# EAGLE schematic fc (EAGLE 5.10)
COPYRIGHT: 213|238|225|225|232; DESCRIPTION_1: 209|245|229|236|224|32|253|235|229|234|242|240|232|247|229|241|234|224|255; DESCRIPTION_2: 239|240|232|237|232|246|232|239|232|224|235|252|237|224|255; DESCRIPTION_3: 247|224|241|242|238|242|238|236|229|240|224; NUMBER: 213|213|213|46|48|48|48|46|48|48|48|46|48|48|48

## Sheet 1 of 4
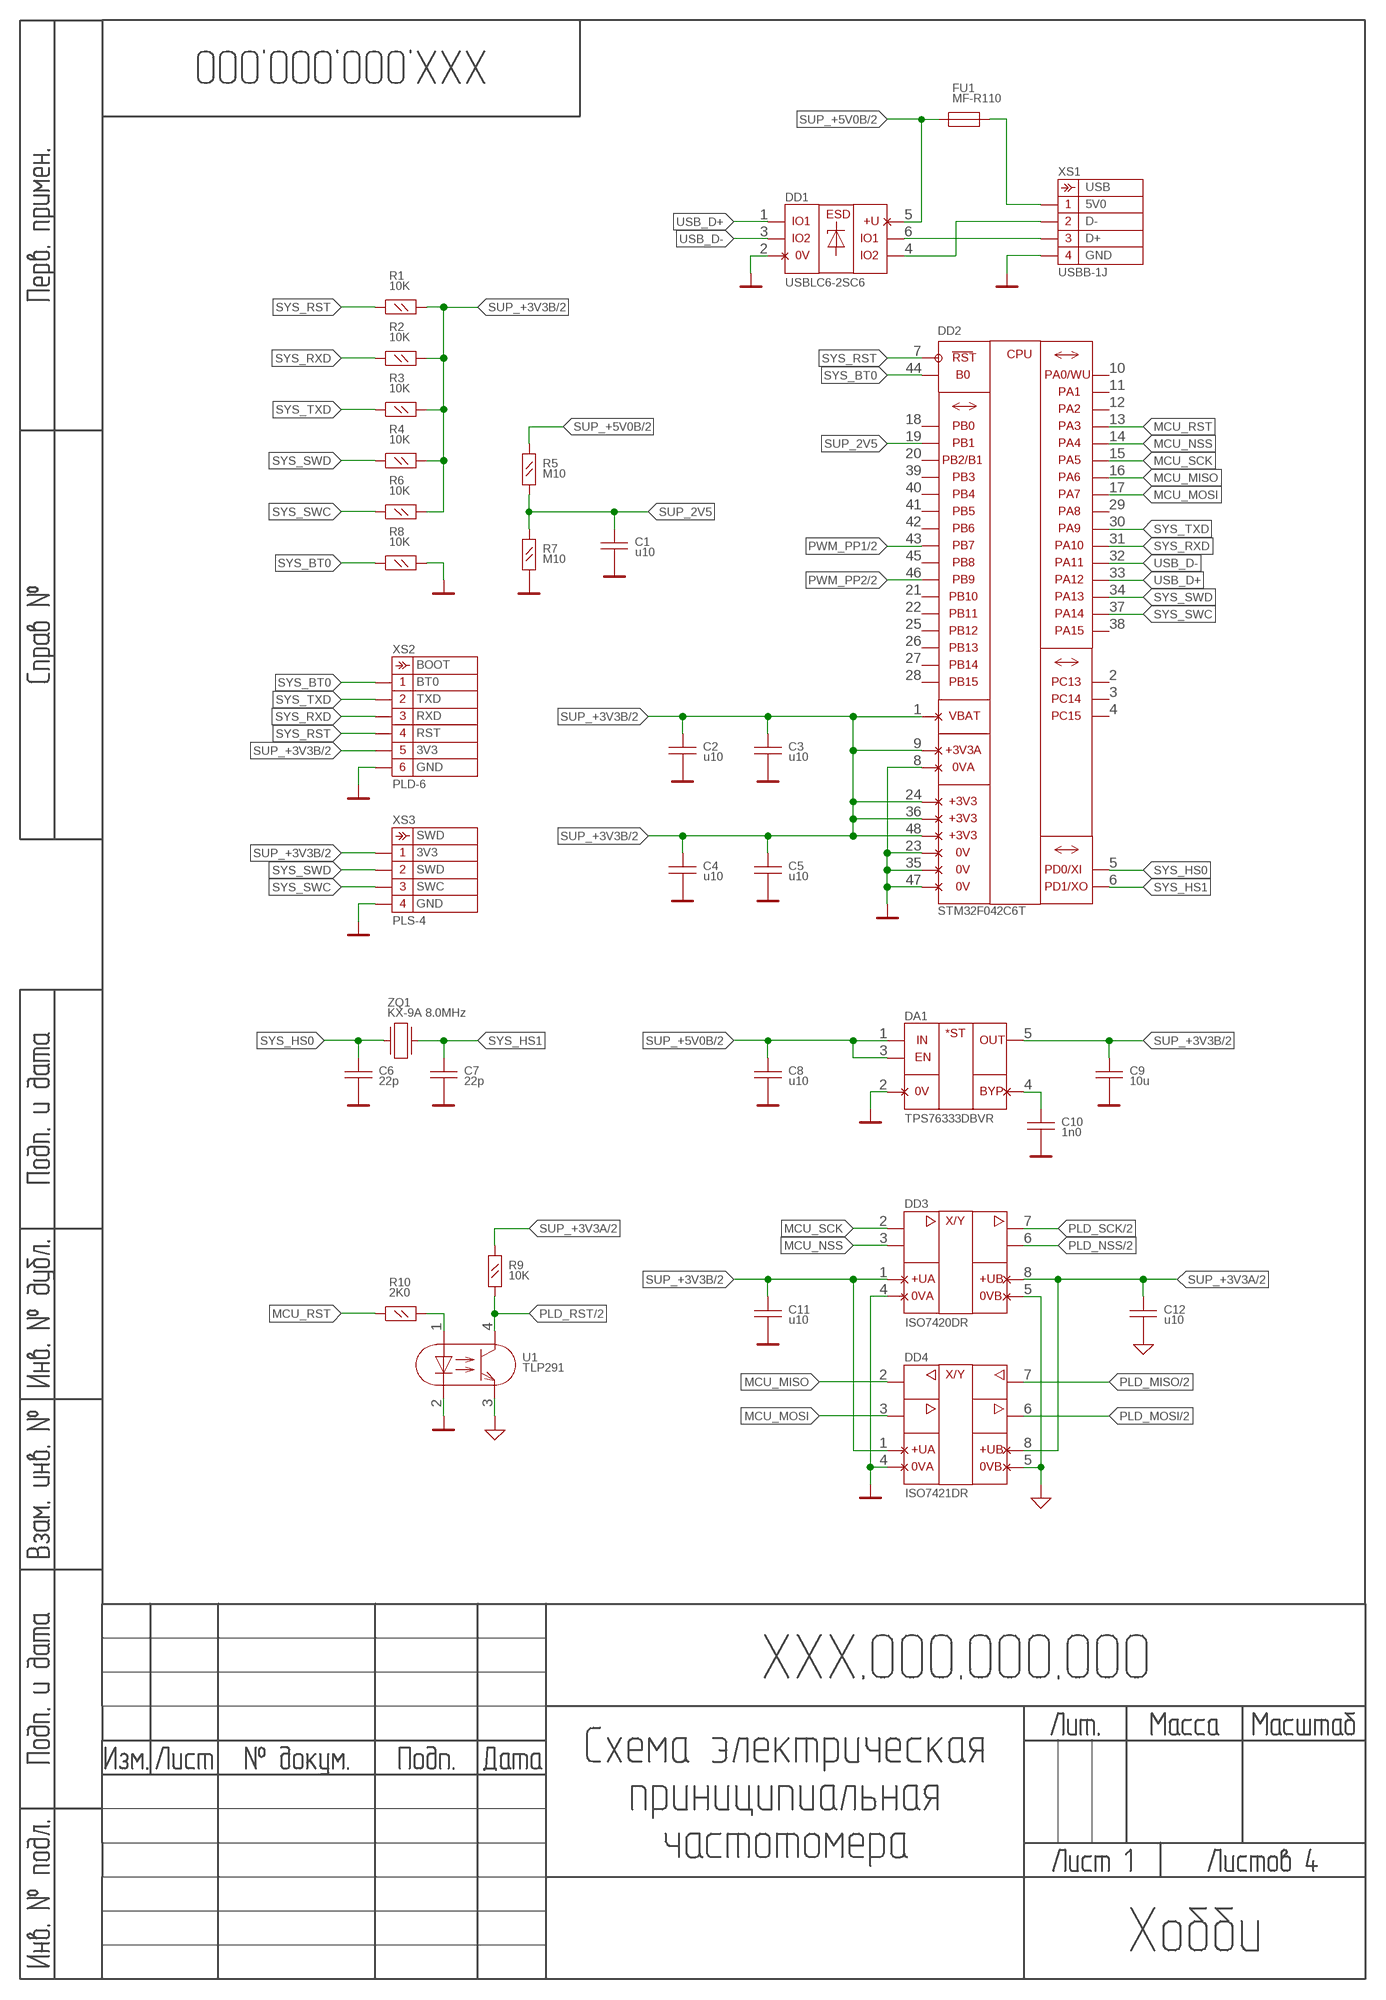
[diagram p0: schematic, sheet 1]

### Parts
C1  u10  CAPACITOR/GENERIC-0805  [GENERIC/0805]
C2  u10  CAPACITOR/GENERIC-0805  [GENERIC/0805]
C3  u10  CAPACITOR/GENERIC-0805  [GENERIC/0805]
C4  u10  CAPACITOR/GENERIC-0805  [GENERIC/0805]
C5  u10  CAPACITOR/GENERIC-0805  [GENERIC/0805]
C6  22p  CAPACITOR/GENERIC-0805  [GENERIC/0805]
C7  22p  CAPACITOR/GENERIC-0805  [GENERIC/0805]
C8  u10  CAPACITOR/GENERIC-0805  [GENERIC/0805]
C9  10u  CAPACITOR/GENERIC-0805  [GENERIC/0805]
C10  1n0  CAPACITOR/GENERIC-0805  [GENERIC/0805]
C11  u10  CAPACITOR/GENERIC-0805  [GENERIC/0805]
C12  u10  CAPACITOR/GENERIC-0805  [GENERIC/0805]
DA1  TPS76333DBVR  ANALOG/REGULATOR/LDK120-SOT23-5  [GENERIC/SOT23-5]
DD1  USBLC6-2SC6  DIGITAL/USBLC6-SOT23-6  [GENERIC/SOT23-6]
DD2  STM32F042C6T  DIGITAL/STM32F10XCXX-QFP48  [LQFP48]
DD3  ISO7420DR  DIGITAL/ADUM1200-SO08  [SO08]
DD4  ISO7421DR  DIGITAL/ADUM1201-SO08  [SO08]
FU1  MF-R110  FUSE-MF-R  [CAPACITOR/3]
R1  10K  RESISTOR/0.125-0805  [GENERIC/0805]
R2  10K  RESISTOR/0.125-0805  [GENERIC/0805]
R3  10K  RESISTOR/0.125-0805  [GENERIC/0805]
R4  10K  RESISTOR/0.125-0805  [GENERIC/0805]
R5  M10  RESISTOR/0.125-0805  [GENERIC/0805]
R6  10K  RESISTOR/0.125-0805  [GENERIC/0805]
R7  M10  RESISTOR/0.125-0805  [GENERIC/0805]
R8  10K  RESISTOR/0.125-0805  [GENERIC/0805]
R9  10K  RESISTOR/0.125-0805  [GENERIC/0805]
R10  2K0  RESISTOR/0.125-0805  [GENERIC/0805]
U1  TLP291  TRANSISTOR/OPTRON/TLP521-1-SO04  [SO04]
XS1  USBB-1J  CONNECTOR/4-USBB-F  [CONNECTOR/4/USBB-F]
XS2  PLD-6  CONNECTOR:6-PLD  [CONNECTOR:6:PLD]
XS3  PLS-4  CONNECTOR/4-PLS  [CONNECTOR/4/PLS]
ZQ1  KX-9A 8.0MHz  QUARTZ/GENERIC-KX-9A  [QUARTZ/KX-9A]

### Nets
0V: C1.2 C2.2 C3.2 C4.2 C5.2 C6.2 C7.2 C8.2 C9.2 C10.2 C11.2 DA1.2(0V) DD1.2(GND) DD2.8(GNDA) DD2.23(GND0) DD2.35(GND1) DD2.47(GND2) DD3.4(GND1) DD4.4(GND1) R7.2 R8.2 U1.2(CATHODE) XS1.4 XS2.6 XS3.4 ; also sheet 2
0VA: C12.2 DD3.5(GND2) DD4.5(GND2) U1.3(EMITTER) ; also sheet 2,3,4
MCU_MISO: DD2.16(PA6) DD4.2(OUTA)
MCU_MOSI: DD2.17(PA7) DD4.3(INB)
MCU_NSS: DD2.14(PA4) DD3.3(INB)
MCU_RST: DD2.13(PA3) R10.1
MCU_SCK: DD2.15(PA5) DD3.2(INA)
N$73: DD1.4(IO22) XS1.2
N$74: DD1.6(IO21) XS1.3
N$75: FU1.2 XS1.1
N$76: R10.2 U1.1(ANODE)
N$79: C10.1 DA1.4(BYP)
PLD_MISO: DD4.7(INA) ; also sheet 2
PLD_MOSI: DD4.6(OUTB) ; also sheet 2
PLD_NSS: DD3.6(OUTB) ; also sheet 2
PLD_RST: R9.2 U1.4(COLLECTOR) ; also sheet 2
PLD_SCK: DD3.7(OUTA) ; also sheet 2
PWM_PP1: DD2.43(PB7) ; also sheet 2
PWM_PP2: DD2.46(PB9) ; also sheet 2
SUP_2V5: C1.1 DD2.19(PB1) R5.2 R7.1
SUP_+3V3A: C12.1 DD3.8(VDD2) DD4.8(VDD2) R9.1 ; also sheet 2,3,4
SUP_+3V3B: C2.1 C3.1 C4.1 C5.1 C9.1 C11.1 DA1.5(OUT) DD2.1(VBAT) DD2.9(VCCA) DD2.24(VCC0) DD2.36(VCC1) DD2.48(VCC2) DD3.1(VDD1) DD4.1(VDD1) R1.2 R2.2 R3.2 R4.2 R6.2 XS2.5 XS3.1 ; also sheet 2
SUP_+5V0B: C8.1 DA1.1(IN) DA1.3(EN) DD1.5(VCC) FU1.1 R5.1 ; also sheet 2
SYS_BT0: DD2.44(BOOT0) R8.1 XS2.1
SYS_HS0: C6.1 DD2.5(PD0) ZQ1.1
SYS_HS1: C7.1 DD2.6(PD1) ZQ1.3
SYS_RST: DD2.7(NRST) R1.1 XS2.4
SYS_RXD: DD2.31(PA10) R2.1 XS2.3
SYS_SWC: DD2.37(PA14) R6.1 XS3.3
SYS_SWD: DD2.34(PA13) R4.1 XS3.2
SYS_TXD: DD2.30(PA9) R3.1 XS2.2
USB_D+: DD1.1(IO11) DD2.33(PA12)
USB_D-: DD1.3(IO12) DD2.32(PA11)
Unconnected: DD2.2(PC13) DD2.3(PC14) DD2.4(PC15) DD2.10(PA0) DD2.11(PA1) DD2.12(PA2) DD2.18(PB0) DD2.20(PB2) DD2.21(PB10) DD2.22(PB11) DD2.25(PB12) DD2.26(PB13) DD2.27(PB14) DD2.28(PB15) DD2.29(PA8) DD2.38(PA15) DD2.39(PB3) DD2.40(PB4) DD2.41(PB5) DD2.42(PB6) DD2.45(PB8)

### Notes on the sheet
- USB
- 5V0
- D-
- D+
- GND
- BOOT
- BT0
- TXD
- RXD
- RST
- 3V3
- GND
- SWD
- 3V3
- SWD
- SWC
- GND

## Sheet 2 of 4
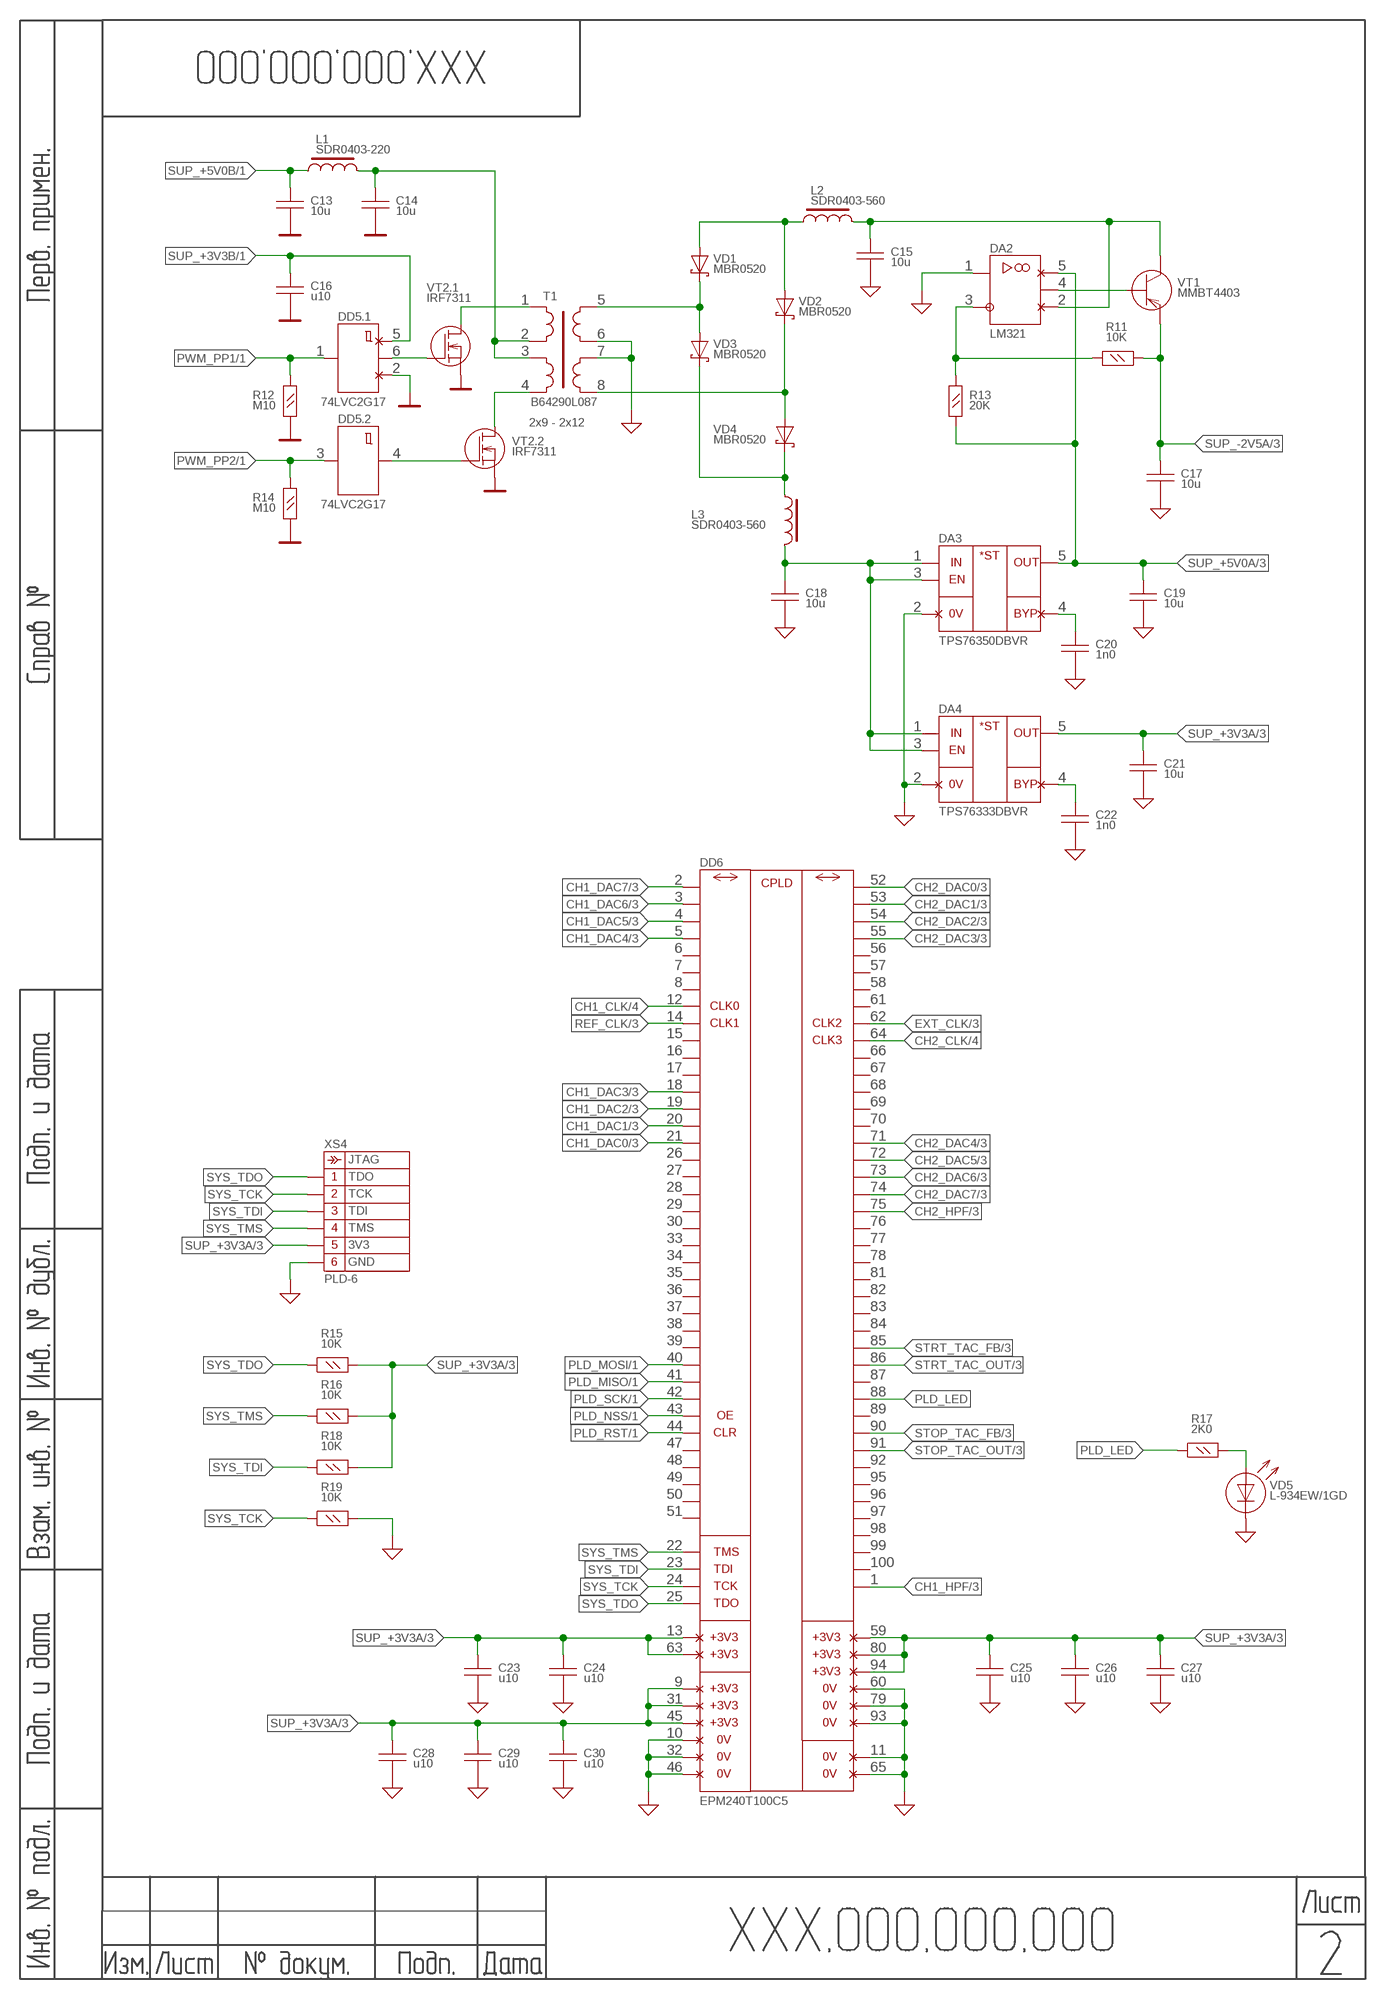
[diagram p1: schematic, sheet 2]

### Parts
C13  10u  CAPACITOR/GENERIC-0805  [GENERIC/0805]
C14  10u  CAPACITOR/GENERIC-0805  [GENERIC/0805]
C15  10u  CAPACITOR/GENERIC-0805  [GENERIC/0805]
C16  u10  CAPACITOR/GENERIC-0805  [GENERIC/0805]
C17  10u  CAPACITOR/GENERIC-0805  [GENERIC/0805]
C18  10u  CAPACITOR/GENERIC-0805  [GENERIC/0805]
C19  10u  CAPACITOR/GENERIC-0805  [GENERIC/0805]
C20  1n0  CAPACITOR/GENERIC-0805  [GENERIC/0805]
C21  10u  CAPACITOR/GENERIC-0805  [GENERIC/0805]
C22  1n0  CAPACITOR/GENERIC-0805  [GENERIC/0805]
C23  u10  CAPACITOR/GENERIC-0805  [GENERIC/0805]
C24  u10  CAPACITOR/GENERIC-0805  [GENERIC/0805]
C25  u10  CAPACITOR/GENERIC-0805  [GENERIC/0805]
C26  u10  CAPACITOR/GENERIC-0805  [GENERIC/0805]
C27  u10  CAPACITOR/GENERIC-0805  [GENERIC/0805]
C28  u10  CAPACITOR/GENERIC-0805  [GENERIC/0805]
C29  u10  CAPACITOR/GENERIC-0805  [GENERIC/0805]
C30  u10  CAPACITOR/GENERIC-0805  [GENERIC/0805]
DA2  LM321  ANALOG/OPAMP/LMV321-SOT23-5  [GENERIC/SOT23-5]
DA3  TPS76350DBVR  ANALOG/REGULATOR/LDK120-SOT23-5  [GENERIC/SOT23-5]
DA4  TPS76333DBVR  ANALOG/REGULATOR/LDK120-SOT23-5  [GENERIC/SOT23-5]
DD5  74LVC2G17  DIGITAL/74HC2G17-SOT23-6  [GENERIC/SOT23-6]
DD6  EPM240T100C5  DIGITAL/EPM240-QFP100  [LQFP100]
L1  SDR0403-220  INDUCTOR/CORE-SDR0403  [INDUCTOR/SDR0403]
L2  SDR0403-560  INDUCTOR/CORE-SDR0403  [INDUCTOR/SDR0403]
L3  SDR0403-560  INDUCTOR/CORE-SDR0403  [INDUCTOR/SDR0403]
R11  10K  RESISTOR/0.125-0805  [GENERIC/0805]
R12  M10  RESISTOR/0.125-0805  [GENERIC/0805]
R13  20K  RESISTOR/0.125-0805  [GENERIC/0805]
R14  M10  RESISTOR/0.125-0805  [GENERIC/0805]
R15  10K  RESISTOR/0.125-0805  [GENERIC/0805]
R16  10K  RESISTOR/0.125-0805  [GENERIC/0805]
R17  2K0  RESISTOR/0.125-0805  [GENERIC/0805]
R18  10K  RESISTOR/0.125-0805  [GENERIC/0805]
R19  10K  RESISTOR/0.125-0805  [GENERIC/0805]
T1  B64290L087  TRANSFORMER/2-2-2-2-B64290L  [TRANSFORMER/B64290L]
VD1  MBR0520  DIODE/SCHOTTKY-SOD123  [GENERIC/SOD123]
VD2  MBR0520  DIODE/SCHOTTKY-SOD123  [GENERIC/SOD123]
VD3  MBR0520  DIODE/SCHOTTKY-SOD123  [GENERIC/SOD123]
VD4  MBR0520  DIODE/SCHOTTKY-SOD123  [GENERIC/SOD123]
VD5  L-934EW/1GD  DIODE/LED-3MM-R  [LED/3/R]
VT1  MMBT4403  TRANSISTOR/PNP-SOT23(BEC)  [GENERIC/SOT23]
VT2  IRF7311  TRANSISTOR/MOSFET/2NE-SO08  [SO08/6]
XS4  PLD-6  CONNECTOR/6-PLD  [CONNECTOR/6/PLD]

### Nets
0V: C13.2 C14.2 C16.2 DD5.2(.0:0V) R12.2 R14.2 VT2.1(.1:SOURCE) VT2.3(.2:SOURCE) ; also sheet 1
0VA: C15.2 C17.2 C18.2 C19.2 C20.2 C21.2 C22.2 C23.2 C24.2 C25.2 C26.2 C27.2 C28.2 C29.2 C30.2 DA2.1(POSITIVE) DA3.2(0V) DA4.2(0V) DD6.10(GNDIO1_1) DD6.11(GNDINT_1) DD6.32(GNDIO1_2) DD6.46(GNDIO1_3) DD6.60(GNDIO2_1) DD6.65(GNDINT_2) DD6.79(GNDIO2_2) DD6.93(GNDIO2_3) R19.2 T1.6 T1.7 VD5.K(CATHODE) XS4.6 ; also sheet 1,3,4
CH1_CLK: DD6.12(IOB1_8) ; also sheet 4
CH1_DAC0: DD6.21(IOB1_16) ; also sheet 3
CH1_DAC1: DD6.20(IOB1_15) ; also sheet 3
CH1_DAC2: DD6.19(IOB1_14) ; also sheet 3
CH1_DAC3: DD6.18(IOB1_13) ; also sheet 3
CH1_DAC4: DD6.5(IOB1_4) ; also sheet 3
CH1_DAC5: DD6.4(IOB1_3) ; also sheet 3
CH1_DAC6: DD6.3(IOB1_2) ; also sheet 3
CH1_DAC7: DD6.2(IOB1_1) ; also sheet 3
CH1_HPF: DD6.1(IOB2_42) ; also sheet 3
CH2_CLK: DD6.64(IOB2_10) ; also sheet 4
CH2_DAC0: DD6.52(IOB2_1) ; also sheet 3
CH2_DAC1: DD6.53(IOB2_2) ; also sheet 3
CH2_DAC2: DD6.54(IOB2_3) ; also sheet 3
CH2_DAC3: DD6.55(IOB2_4) ; also sheet 3
CH2_DAC4: DD6.71(IOB2_16) ; also sheet 3
CH2_DAC5: DD6.72(IOB2_17) ; also sheet 3
CH2_DAC6: DD6.73(IOB2_18) ; also sheet 3
CH2_DAC7: DD6.74(IOB2_19) ; also sheet 3
CH2_HPF: DD6.75(IOB2_20) ; also sheet 3
EXT_CLK: DD6.62(IOB2_9) ; also sheet 3
N$64: R17.2 VD5.A(ANODE)
N$71: C14.1 L1.2 T1.2 T1.3
N$77: T1.4 VT2.5,6(.2:DRAIN)
N$78: DA2.3(NEGATIVE) R11.2 R13.1
N$80: T1.1 VT2.7,8(.1:DRAIN)
N$81: DD5.4(.2:Y) VT2.4(.2:GATE)
N$82: DD5.6(.1:Y) VT2.2(.1:GATE)
N$83: T1.8 VD2.C(CATHODE) VD4.A(ANODE)
N$84: T1.5 VD1.C(CATHODE) VD3.A(ANODE)
N$85: L3.1 VD3.C(CATHODE) VD4.C(CATHODE)
N$86: L2.1 VD1.A(ANODE) VD2.A(ANODE)
N$87: DA2.4(OUT) VT1.1(BASE)
N$88: C18.1 DA3.1(IN) DA3.3(EN) DA4.1(IN) DA4.3(EN) L3.2
N$89: C20.1 DA3.4(BYP)
N$90: C22.1 DA4.4(BYP)
N$91: C15.1 DA2.2(-U) L2.2 VT1.3(COLLECTOR)
PLD_LED: DD6.88(IOB2_31) R17.1
PLD_MISO: DD6.41(IOB1_30) ; also sheet 1
PLD_MOSI: DD6.40(IOB1_29) ; also sheet 1
PLD_NSS: DD6.43(IOB1_32) ; also sheet 1
PLD_RST: DD6.44(IOB1_33) ; also sheet 1
PLD_SCK: DD6.42(IOB1_31) ; also sheet 1
PWM_PP1: DD5.1(.1:A) R12.1 ; also sheet 1
PWM_PP2: DD5.3(.2:A) R14.1 ; also sheet 1
REF_CLK: DD6.14(IOB1_9) ; also sheet 3
STOP_TAC_FB: DD6.90(IOB2_33) ; also sheet 3
STOP_TAC_OUT: DD6.91(IOB2_34) ; also sheet 3
STRT_TAC_FB: DD6.85(IOB2_28) ; also sheet 3
STRT_TAC_OUT: DD6.86(IOB2_29) ; also sheet 3
SUP_+3V3A: C21.1 C23.1 C24.1 C25.1 C26.1 C27.1 C28.1 C29.1 C30.1 DA4.5(OUT) DD6.9(VCCIO1_1) DD6.13(VCCINT_1) DD6.31(VCCIO1_2) DD6.45(VCCIO1_3) DD6.59(VCCIO2_1) DD6.63(VCCINT_2) DD6.80(VCCIO2_2) DD6.94(VCCIO2_3) R15.2 R16.2 R18.2 XS4.5 ; also sheet 1,3,4
SUP_+3V3B: C16.1 DD5.5(.0:+U) ; also sheet 1
SUP_+5V0A: C19.1 DA2.5(+U) DA3.5(OUT) R13.2 ; also sheet 3,4
SUP_+5V0B: C13.1 L1.1 ; also sheet 1
SUP_-2V5A: C17.1 R11.1 VT1.2(EMITTER) ; also sheet 3,4
SYS_TCK: DD6.24(TCK) R19.1 XS4.2
SYS_TDI: DD6.23(TDI) R18.1 XS4.3
SYS_TDO: DD6.25(TDO) R15.1 XS4.1
SYS_TMS: DD6.22(TMS) R16.1 XS4.4
Unconnected: DD6.6(IOB1_5) DD6.7(IOB1_6) DD6.8(IOB1_7) DD6.15(IOB1_10) DD6.16(IOB1_11) DD6.17(IOB1_12) DD6.26(IOB1_17) DD6.27(IOB1_18) DD6.28(IOB1_19) DD6.29(IOB1_20) DD6.30(IOB1_21) DD6.33(IOB1_22) DD6.34(IOB1_23) DD6.35(IOB1_24) DD6.36(IOB1_25) DD6.37(IOB1_26) DD6.38(IOB1_27) DD6.39(IOB1_28) DD6.47(IOB1_34) DD6.48(IOB1_35) DD6.49(IOB1_36) DD6.50(IOB1_37) DD6.51(IOB1_38) DD6.56(IOB2_5) DD6.57(IOB2_6) DD6.58(IOB2_7) DD6.61(IOB2_8) DD6.66(IOB2_11) DD6.67(IOB2_12) DD6.68(IOB2_13) DD6.69(IOB2_14) DD6.70(IOB2_15) DD6.76(IOB2_21) DD6.77(IOB2_22) DD6.78(IOB2_23) DD6.81(IOB2_24) DD6.82(IOB2_25) DD6.83(IOB2_26) DD6.84(IOB2_27) DD6.87(IOB2_30) DD6.89(IOB2_32) DD6.92(IOB2_35) DD6.95(IOB2_36) DD6.96(IOB2_37) DD6.97(IOB2_38) DD6.98(IOB2_39) DD6.99(IOB2_40) DD6.100(IOB2_41)

### Notes on the sheet
- 2x9 - 2x12
- JTAG
- TDO
- TCK
- TDI
- TMS
- 3V3
- GND

## Sheet 3 of 4
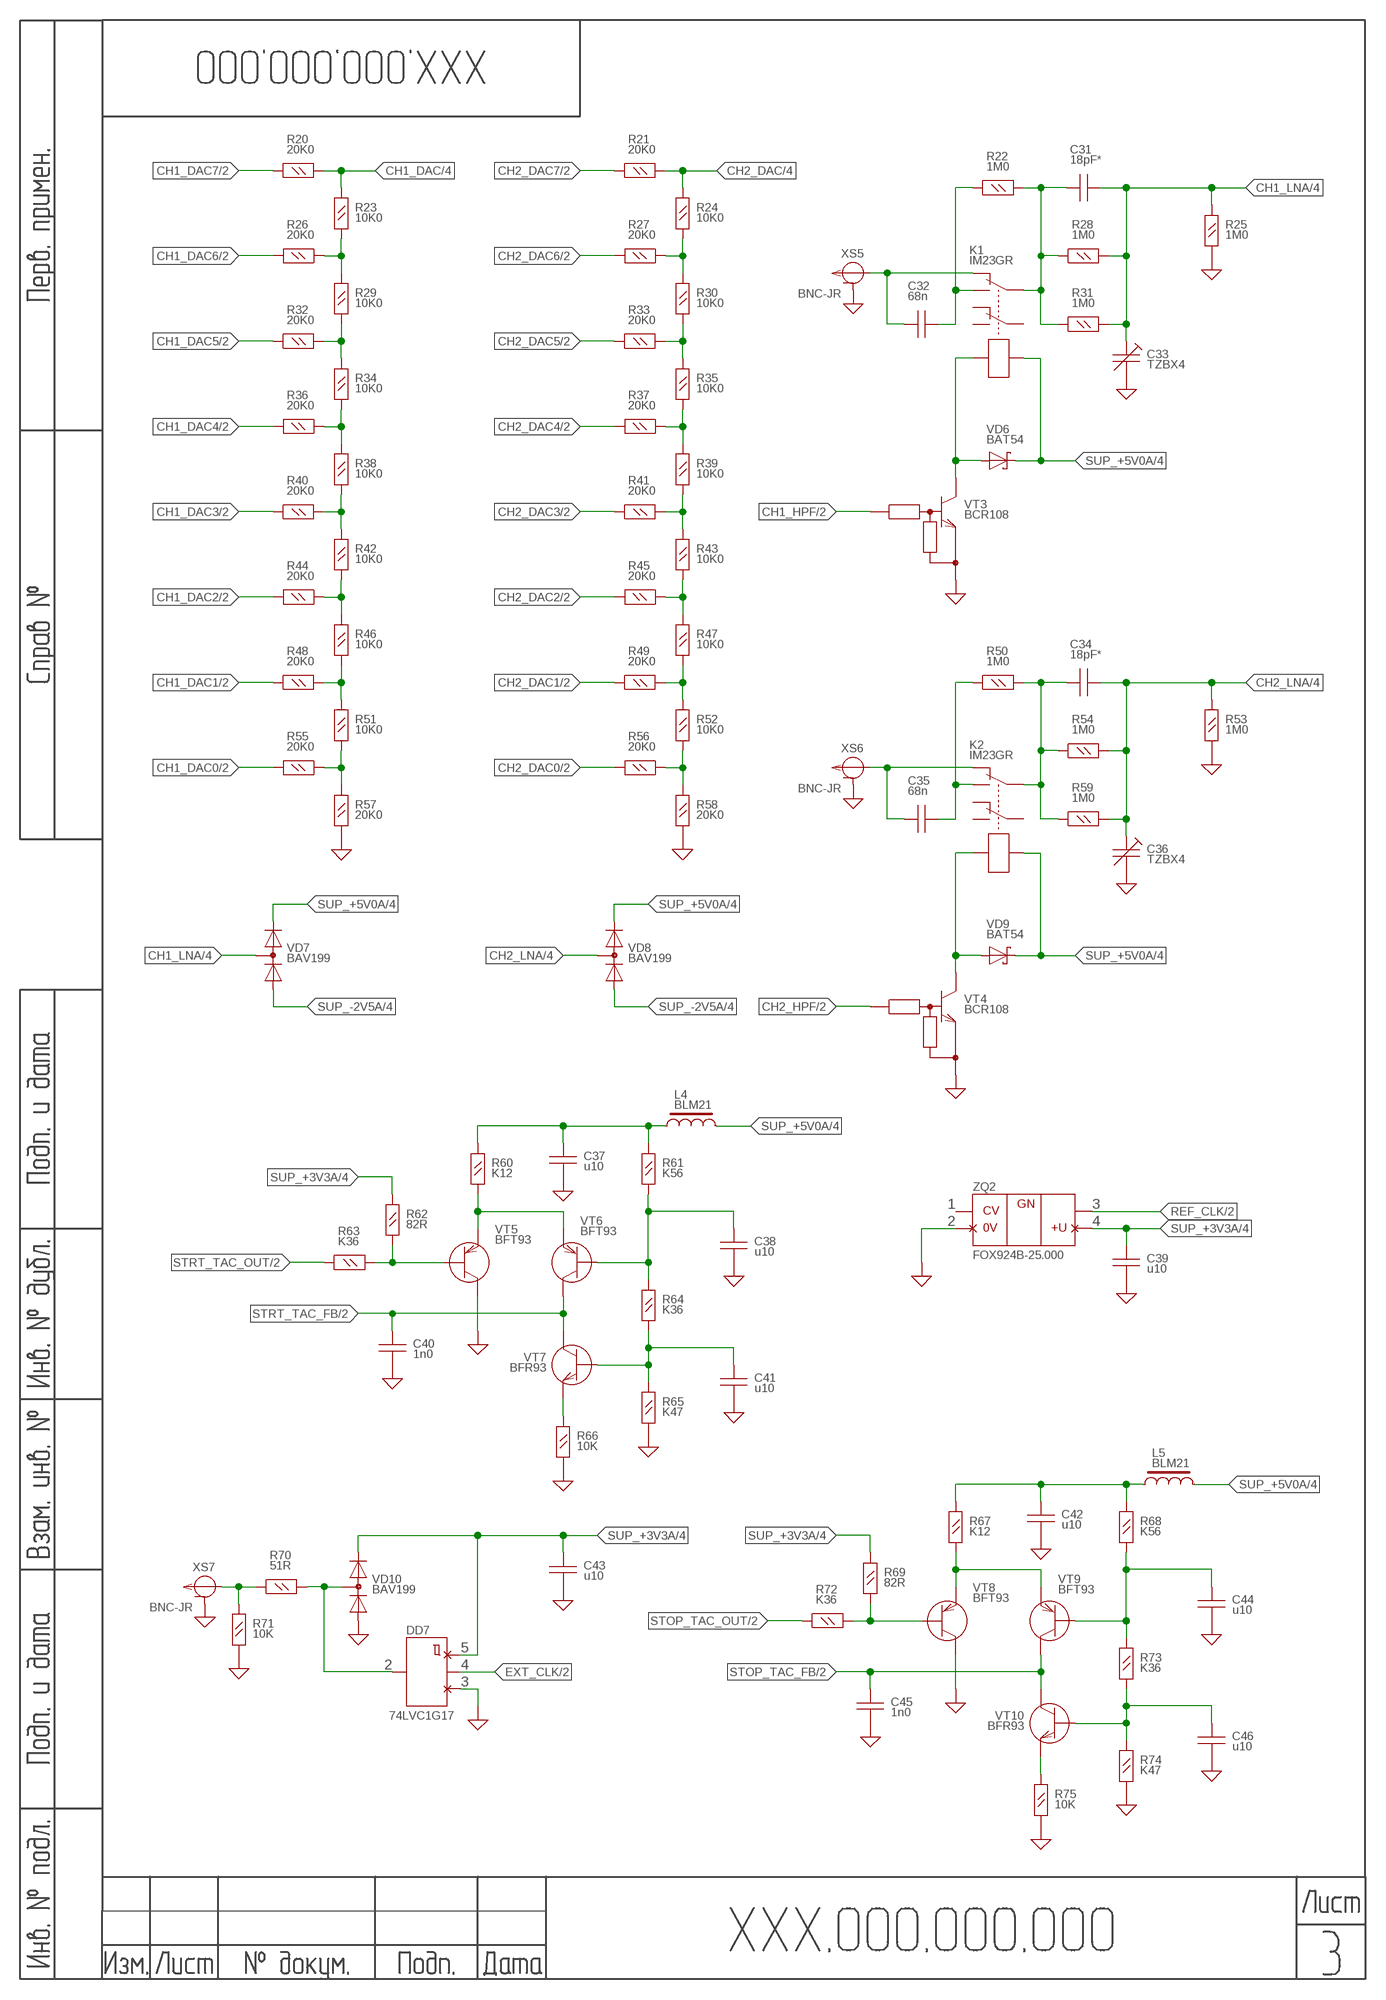
[diagram p2: schematic, sheet 3]

### Parts
C31  18pF*  CAPACITOR/GENERIC-0805  [GENERIC/0805]
C32  68n  CAPACITOR/GENERIC-0805  [GENERIC/0805]
C33  TZBX4  CAPACITOR/TRIM-TZBX4  [CAPACITOR/TRIM/TZBX4]
C34  18pF*  CAPACITOR/GENERIC-0805  [GENERIC/0805]
C35  68n  CAPACITOR/GENERIC-0805  [GENERIC/0805]
C36  TZBX4  CAPACITOR/TRIM-TZBX4  [CAPACITOR/TRIM/TZBX4]
C37  u10  CAPACITOR/GENERIC-0805  [GENERIC/0805]
C38  u10  CAPACITOR/GENERIC-0805  [GENERIC/0805]
C39  u10  CAPACITOR/GENERIC-0805  [GENERIC/0805]
C40  1n0  CAPACITOR/GENERIC-3  [CAPACITOR/3]
C41  u10  CAPACITOR/GENERIC-0805  [GENERIC/0805]
C42  u10  CAPACITOR/GENERIC-0805  [GENERIC/0805]
C43  u10  CAPACITOR/GENERIC-0805  [GENERIC/0805]
C44  u10  CAPACITOR/GENERIC-0805  [GENERIC/0805]
C45  1n0  CAPACITOR/GENERIC-3  [CAPACITOR/3]
C46  u10  CAPACITOR/GENERIC-0805  [GENERIC/0805]
DD7  74LVC1G17  DIGITAL/74HC1G17-SOT23-5  [GENERIC/SOT23-5]
K1  IM23GR  RELAY/2NCNO-10X6  [RELAY/2/6/IM]
K2  IM23GR  RELAY/2NCNO-10X6  [RELAY/2/6/IM]
L4  BLM21  INDUCTOR/CORE-0805  [GENERIC/0805]
L5  BLM21  INDUCTOR/CORE-0805  [GENERIC/0805]
R20  20K0  RESISTOR/0.125-0805  [GENERIC/0805]
R21  20K0  RESISTOR/0.125-0805  [GENERIC/0805]
R22  1M0  RESISTOR/0.125-0805  [GENERIC/0805]
R23  10K0  RESISTOR/0.125-0805  [GENERIC/0805]
R24  10K0  RESISTOR/0.125-0805  [GENERIC/0805]
R25  1M0  RESISTOR/0.125-0805  [GENERIC/0805]
R26  20K0  RESISTOR/0.125-0805  [GENERIC/0805]
R27  20K0  RESISTOR/0.125-0805  [GENERIC/0805]
R28  1M0  RESISTOR/0.125-0805  [GENERIC/0805]
R29  10K0  RESISTOR/0.125-0805  [GENERIC/0805]
R30  10K0  RESISTOR/0.125-0805  [GENERIC/0805]
R31  1M0  RESISTOR/0.125-0805  [GENERIC/0805]
R32  20K0  RESISTOR/0.125-0805  [GENERIC/0805]
R33  20K0  RESISTOR/0.125-0805  [GENERIC/0805]
R34  10K0  RESISTOR/0.125-0805  [GENERIC/0805]
R35  10K0  RESISTOR/0.125-0805  [GENERIC/0805]
R36  20K0  RESISTOR/0.125-0805  [GENERIC/0805]
R37  20K0  RESISTOR/0.125-0805  [GENERIC/0805]
R38  10K0  RESISTOR/0.125-0805  [GENERIC/0805]
R39  10K0  RESISTOR/0.125-0805  [GENERIC/0805]
R40  20K0  RESISTOR/0.125-0805  [GENERIC/0805]
R41  20K0  RESISTOR/0.125-0805  [GENERIC/0805]
R42  10K0  RESISTOR/0.125-0805  [GENERIC/0805]
R43  10K0  RESISTOR/0.125-0805  [GENERIC/0805]
R44  20K0  RESISTOR/0.125-0805  [GENERIC/0805]
R45  20K0  RESISTOR/0.125-0805  [GENERIC/0805]
R46  10K0  RESISTOR/0.125-0805  [GENERIC/0805]
R47  10K0  RESISTOR/0.125-0805  [GENERIC/0805]
R48  20K0  RESISTOR/0.125-0805  [GENERIC/0805]
R49  20K0  RESISTOR/0.125-0805  [GENERIC/0805]
R50  1M0  RESISTOR/0.125-0805  [GENERIC/0805]
R51  10K0  RESISTOR/0.125-0805  [GENERIC/0805]
R52  10K0  RESISTOR/0.125-0805  [GENERIC/0805]
R53  1M0  RESISTOR/0.125-0805  [GENERIC/0805]
R54  1M0  RESISTOR/0.125-0805  [GENERIC/0805]
R55  20K0  RESISTOR/0.125-0805  [GENERIC/0805]
R56  20K0  RESISTOR/0.125-0805  [GENERIC/0805]
R57  20K0  RESISTOR/0.125-0805  [GENERIC/0805]
R58  20K0  RESISTOR/0.125-0805  [GENERIC/0805]
R59  1M0  RESISTOR/0.125-0805  [GENERIC/0805]
R60  K12  RESISTOR/0.125-0805  [GENERIC/0805]
R61  K56  RESISTOR/0.125-0805  [GENERIC/0805]
R62  82R  RESISTOR/0.125-0805  [GENERIC/0805]
R63  K36  RESISTOR/0.125-0805  [GENERIC/0805]
R64  K36  RESISTOR/0.125-0805  [GENERIC/0805]
R65  K47  RESISTOR/0.125-0805  [GENERIC/0805]
R66  10K  RESISTOR/0.125-0805  [GENERIC/0805]
R67  K12  RESISTOR/0.125-0805  [GENERIC/0805]
R68  K56  RESISTOR/0.125-0805  [GENERIC/0805]
R69  82R  RESISTOR/0.125-0805  [GENERIC/0805]
R70  51R  RESISTOR/0.125-0805  [GENERIC/0805]
R71  10K  RESISTOR/0.125-0805  [GENERIC/0805]
R72  K36  RESISTOR/0.125-0805  [GENERIC/0805]
R73  K36  RESISTOR/0.125-0805  [GENERIC/0805]
R74  K47  RESISTOR/0.125-0805  [GENERIC/0805]
R75  10K  RESISTOR/0.125-0805  [GENERIC/0805]
VD6  BAT54  DIODE/SCHOTTKY-SOT23  [GENERIC/SOT23]
VD7  BAV199  DIODE/2/AC-SOT23  [GENERIC/SOT23]
VD8  BAV199  DIODE/2/AC-SOT23  [GENERIC/SOT23]
VD9  BAT54  DIODE/SCHOTTKY-SOT23  [GENERIC/SOT23]
VD10  BAV199  DIODE/2/AC-SOT23  [GENERIC/SOT23]
VT3  BCR108  TRANSISTOR/NPN/SWITCH-SOT23  [GENERIC/SOT23]
VT4  BCR108  TRANSISTOR/NPN/SWITCH-SOT23  [GENERIC/SOT23]
VT5  BFT93  TRANSISTOR/PNP-SOT23(BEC)  [GENERIC/SOT23]
VT6  BFT93  TRANSISTOR/PNP-SOT23(BEC)  [GENERIC/SOT23]
VT7  BFR93  TRANSISTOR/NPN-SOT23(BEC)  [GENERIC/SOT23]
VT8  BFT93  TRANSISTOR/PNP-SOT23(BEC)  [GENERIC/SOT23]
VT9  BFT93  TRANSISTOR/PNP-SOT23(BEC)  [GENERIC/SOT23]
VT10  BFR93  TRANSISTOR/NPN-SOT23(BEC)  [GENERIC/SOT23]
XS5  BNC-JR  CONNECTOR/2/BNC  [CONNECTOR/2/BNC]
XS6  BNC-JR  CONNECTOR/2/BNC  [CONNECTOR/2/BNC]
XS7  BNC-JR  CONNECTOR/2/BNC  [CONNECTOR/2/BNC]
ZQ2  FOX924B-25.000  QUARTZ/BLOCK-KX-9A  [QUARTZ/KX-9A]

### Nets
0VA: C33.2 C36.2 C37.2 C38.2 C39.2 C40.2 C41.2 C42.2 C43.2 C44.2 C45.2 C46.2 DD7.3(0V) R25.2 R53.2 R57.2 R58.2 R65.2 R66.2 R71.2 R74.2 R75.2 VD10.1(ANODE) VT3.2(EMITTER) VT4.2(EMITTER) VT5.3(COLLECTOR) VT8.3(COLLECTOR) XS5.2 XS6.2 XS7.2 ZQ2.2(0V) ; also sheet 1,2,4
CH1_DAC: R20.2 R23.1 ; also sheet 4
CH1_DAC0: R55.2 ; also sheet 2
CH1_DAC1: R48.1 ; also sheet 2
CH1_DAC2: R44.2 ; also sheet 2
CH1_DAC3: R40.1 ; also sheet 2
CH1_DAC4: R36.2 ; also sheet 2
CH1_DAC5: R32.1 ; also sheet 2
CH1_DAC6: R26.2 ; also sheet 2
CH1_DAC7: R20.1 ; also sheet 2
CH1_HPF: VT3.1(BASE) ; also sheet 2
CH1_LNA: C31.2 C33.1 R25.1 R28.2 R31.2 VD7.3(ANODECATHODE) ; also sheet 4
CH2_DAC: R21.2 R24.1 ; also sheet 4
CH2_DAC0: R56.2 ; also sheet 2
CH2_DAC1: R49.1 ; also sheet 2
CH2_DAC2: R45.2 ; also sheet 2
CH2_DAC3: R41.1 ; also sheet 2
CH2_DAC4: R37.2 ; also sheet 2
CH2_DAC5: R33.1 ; also sheet 2
CH2_DAC6: R27.2 ; also sheet 2
CH2_DAC7: R21.1 ; also sheet 2
CH2_HPF: VT4.1(BASE) ; also sheet 2
CH2_LNA: C34.2 C36.1 R53.1 R54.2 R59.2 VD8.3(ANODECATHODE) ; also sheet 4
EXT_CLK: DD7.4(Y) ; also sheet 2
N$1: R23.2 R26.1 R29.1
N$5: R34.2 R36.1 R38.1
N$6: R29.2 R32.2 R34.1
N$9: R42.2 R44.1 R46.1
N$10: R38.2 R40.2 R42.1
N$13: R51.2 R55.1 R57.1
N$14: R46.2 R48.2 R51.1
N$17: R24.2 R27.1 R30.1
N$21: R35.2 R37.1 R39.1
N$22: R30.2 R33.2 R35.1
N$25: R43.2 R45.1 R47.1
N$26: R39.2 R41.2 R43.1
N$29: R52.2 R56.1 R58.1
N$30: R47.2 R49.2 R52.1
N$49: C35.1 K2.7(2NC) XS6.1
N$50: C32.1 K1.7(2NC) XS5.1
N$51: C32.2 K1.5(2NO) R22.1
N$52: C31.1 K1.6(COM2) R22.2 R28.1 R31.1
N$53: C35.2 K2.5(2NO) R50.1
N$54: R60.2 VT5.2(EMITTER) VT6.2(EMITTER)
N$55: K1.8(P2) VD6.1(ANODE) VT3.3(COLLECTOR)
N$56: K2.8(P2) VD9.1(ANODE) VT4.3(COLLECTOR)
N$57: R70.1 R71.1 XS7.1
N$58: R66.1 VT7.2(EMITTER)
N$59: R67.2 VT8.2(EMITTER) VT9.2(EMITTER)
N$60: C41.1 R64.2 R65.1 VT7.1(BASE)
N$61: C38.1 R61.2 R64.1 VT6.1(BASE)
N$62: C34.1 K2.6(COM2) R50.2 R54.1 R59.1
N$63: R62.2 R63.2 VT5.1(BASE)
N$65: C37.1 L4.1 R60.1 R61.1
N$66: DD7.2(A) R70.2 VD10.3(ANODECATHODE)
N$67: R75.1 VT10.2(EMITTER)
N$68: C46.1 R73.2 R74.1 VT10.1(BASE)
N$69: C44.1 R68.2 R73.1 VT9.1(BASE)
N$70: R69.2 R72.2 VT8.1(BASE)
N$72: C42.1 L5.1 R67.1 R68.1
REF_CLK: ZQ2.3(OUT) ; also sheet 2
STOP_TAC_FB: C45.1 VT9.3(COLLECTOR) VT10.3(COLLECTOR) ; also sheet 2
STOP_TAC_OUT: R72.1 ; also sheet 2
STRT_TAC_FB: C40.1 VT6.3(COLLECTOR) VT7.3(COLLECTOR) ; also sheet 2
STRT_TAC_OUT: R63.1 ; also sheet 2
SUP_+3V3A: C39.1 C43.1 DD7.5(+U) R62.1 R69.1 VD10.2(CATHODE) ZQ2.4(+U) ; also sheet 1,2,4
SUP_+5V0A: K1.1 K2.1 L4.2 L5.2 VD6.3(CATHODE) VD7.2(CATHODE) VD8.2(CATHODE) VD9.3(CATHODE) ; also sheet 2,4
SUP_-2V5A: VD7.1(ANODE) VD8.1(ANODE) ; also sheet 2,4
Unconnected: K1.2(1NC) K1.3(COM1) K1.4(1NO) K2.2(1NC) K2.3(COM1) K2.4(1NO) ZQ2.1(CV)

## Sheet 4 of 4
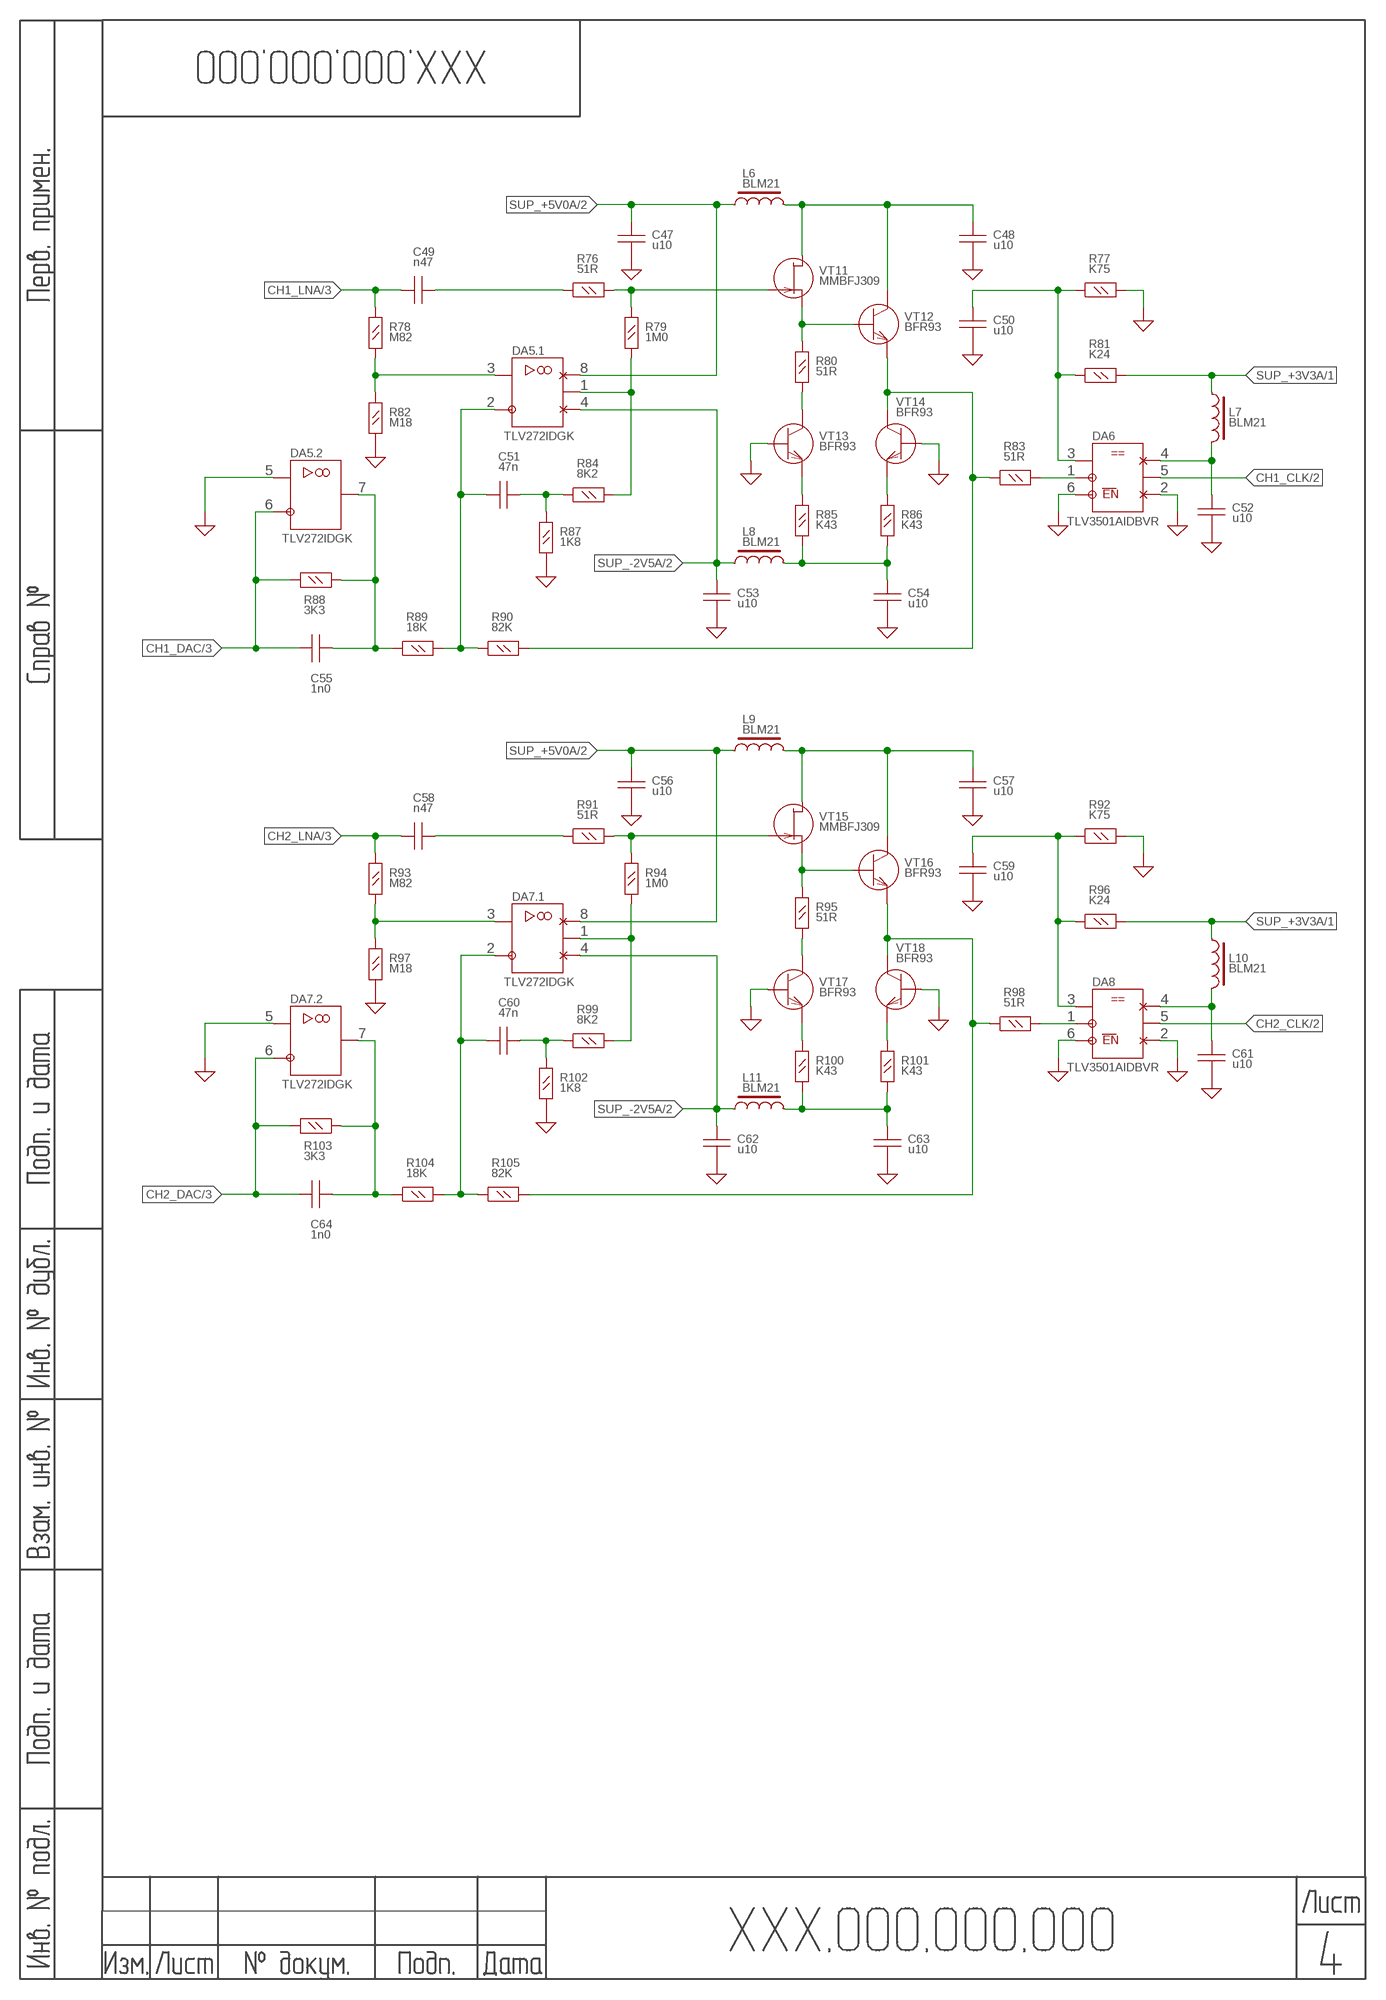
[diagram p3: schematic, sheet 4]

### Parts
C47  u10  CAPACITOR/GENERIC-0805  [GENERIC/0805]
C48  u10  CAPACITOR/GENERIC-0805  [GENERIC/0805]
C49  n47  CAPACITOR/GENERIC-0805  [GENERIC/0805]
C50  u10  CAPACITOR/GENERIC-0805  [GENERIC/0805]
C51  47n  CAPACITOR/GENERIC-0805  [GENERIC/0805]
C52  u10  CAPACITOR/GENERIC-0805  [GENERIC/0805]
C53  u10  CAPACITOR/GENERIC-0805  [GENERIC/0805]
C54  u10  CAPACITOR/GENERIC-0805  [GENERIC/0805]
C55  1n0  CAPACITOR/GENERIC-0805  [GENERIC/0805]
C56  u10  CAPACITOR/GENERIC-0805  [GENERIC/0805]
C57  u10  CAPACITOR/GENERIC-0805  [GENERIC/0805]
C58  n47  CAPACITOR/GENERIC-0805  [GENERIC/0805]
C59  u10  CAPACITOR/GENERIC-0805  [GENERIC/0805]
C60  47n  CAPACITOR/GENERIC-0805  [GENERIC/0805]
C61  u10  CAPACITOR/GENERIC-0805  [GENERIC/0805]
C62  u10  CAPACITOR/GENERIC-0805  [GENERIC/0805]
C63  u10  CAPACITOR/GENERIC-0805  [GENERIC/0805]
C64  1n0  CAPACITOR/GENERIC-0805  [GENERIC/0805]
DA5  TLV272IDGK  ANALOG/OPAMP/LM158-MSOP08  [MSOP08]
DA6  TLV3501AIDBVR  ANALOG/COMPARATOR/TLV3501-SOT23-6  [GENERIC/SOT23-6]
DA7  TLV272IDGK  ANALOG/OPAMP/LM158-MSOP08  [MSOP08]
DA8  TLV3501AIDBVR  ANALOG/COMPARATOR/TLV3501-SOT23-6  [GENERIC/SOT23-6]
L6  BLM21  INDUCTOR/CORE-0805  [GENERIC/0805]
L7  BLM21  INDUCTOR/CORE-0805  [GENERIC/0805]
L8  BLM21  INDUCTOR/CORE-0805  [GENERIC/0805]
L9  BLM21  INDUCTOR/CORE-0805  [GENERIC/0805]
L10  BLM21  INDUCTOR/CORE-0805  [GENERIC/0805]
L11  BLM21  INDUCTOR/CORE-0805  [GENERIC/0805]
R76  51R  RESISTOR/0.125-0805  [GENERIC/0805]
R77  K75  RESISTOR/0.125-0805  [GENERIC/0805]
R78  M82  RESISTOR/0.125-0805  [GENERIC/0805]
R79  1M0  RESISTOR/0.125-0805  [GENERIC/0805]
R80  51R  RESISTOR/0.125-0805  [GENERIC/0805]
R81  K24  RESISTOR/0.125-0805  [GENERIC/0805]
R82  M18  RESISTOR/0.125-0805  [GENERIC/0805]
R83  51R  RESISTOR/0.125-0805  [GENERIC/0805]
R84  8K2  RESISTOR/0.125-0805  [GENERIC/0805]
R85  K43  RESISTOR/0.125-0805  [GENERIC/0805]
R86  K43  RESISTOR/0.125-0805  [GENERIC/0805]
R87  1K8  RESISTOR/0.125-0805  [GENERIC/0805]
R88  3K3  RESISTOR/0.125-0805  [GENERIC/0805]
R89  18K  RESISTOR/0.125-0805  [GENERIC/0805]
R90  82K  RESISTOR/0.125-0805  [GENERIC/0805]
R91  51R  RESISTOR/0.125-0805  [GENERIC/0805]
R92  K75  RESISTOR/0.125-0805  [GENERIC/0805]
R93  M82  RESISTOR/0.125-0805  [GENERIC/0805]
R94  1M0  RESISTOR/0.125-0805  [GENERIC/0805]
R95  51R  RESISTOR/0.125-0805  [GENERIC/0805]
R96  K24  RESISTOR/0.125-0805  [GENERIC/0805]
R97  M18  RESISTOR/0.125-0805  [GENERIC/0805]
R98  51R  RESISTOR/0.125-0805  [GENERIC/0805]
R99  8K2  RESISTOR/0.125-0805  [GENERIC/0805]
R100  K43  RESISTOR/0.125-0805  [GENERIC/0805]
R101  K43  RESISTOR/0.125-0805  [GENERIC/0805]
R102  1K8  RESISTOR/0.125-0805  [GENERIC/0805]
R103  3K3  RESISTOR/0.125-0805  [GENERIC/0805]
R104  18K  RESISTOR/0.125-0805  [GENERIC/0805]
R105  82K  RESISTOR/0.125-0805  [GENERIC/0805]
VT11  MMBFJ309  TRANSISTOR/JFET/N-SOT23(DSG)  [GENERIC/SOT23]
VT12  BFR93  TRANSISTOR/NPN-SOT23(BEC)  [GENERIC/SOT23]
VT13  BFR93  TRANSISTOR/NPN-SOT23(BEC)  [GENERIC/SOT23]
VT14  BFR93  TRANSISTOR/NPN-SOT23(BEC)  [GENERIC/SOT23]
VT15  MMBFJ309  TRANSISTOR/JFET/N-SOT23(DSG)  [GENERIC/SOT23]
VT16  BFR93  TRANSISTOR/NPN-SOT23(BEC)  [GENERIC/SOT23]
VT17  BFR93  TRANSISTOR/NPN-SOT23(BEC)  [GENERIC/SOT23]
VT18  BFR93  TRANSISTOR/NPN-SOT23(BEC)  [GENERIC/SOT23]

### Nets
0VA: C47.2 C48.2 C50.2 C52.2 C53.2 C54.2 C56.2 C57.2 C59.2 C61.2 C62.2 C63.2 DA5.5(.2:POSITIVE) DA6.2(-U) DA6.6(SHUTDOWN) DA7.5(.2:POSITIVE) DA8.2(-U) DA8.6(SHUTDOWN) R77.2 R82.2 R87.2 R92.2 R97.2 R102.2 VT13.1(BASE) VT14.1(BASE) VT17.1(BASE) VT18.1(BASE) ; also sheet 1,2,3
CH1_CLK: DA6.5(OUT) ; also sheet 2
CH1_DAC: C55.2 DA5.6(.2:NEGATIVE) R88.2 ; also sheet 3
CH1_LNA: C49.1 R78.1 ; also sheet 3
CH2_CLK: DA8.5(OUT) ; also sheet 2
CH2_DAC: C64.2 DA7.6(.2:NEGATIVE) R103.2 ; also sheet 3
CH2_LNA: C58.1 R93.1 ; also sheet 3
N$2: DA5.3(.1:POSITIVE) R78.2 R82.1
N$3: C51.1 DA5.2(.1:NEGATIVE) R89.2 R90.1
N$4: DA7.3(.1:POSITIVE) R93.2 R97.1
N$7: DA6.1(NEGATIVE) R83.2
N$8: R76.2 R79.1 VT11.3(GATE)
N$11: C49.2 R76.1
N$12: C51.2 R84.1 R87.1
N$15: DA5.1(.1:OUT) R79.2 R84.2
N$16: C55.1 DA5.7(.2:OUT) R88.1 R89.1
N$18: R80.2 VT13.3(COLLECTOR)
N$19: R85.1 VT13.2(EMITTER)
N$20: R86.1 VT14.2(EMITTER)
N$23: R80.1 VT11.2(SOURCE) VT12.1(BASE)
N$24: R83.1 R90.2 VT12.2(EMITTER) VT14.3(COLLECTOR)
N$27: C54.1 L8.2 R85.2 R86.2
N$28: C48.1 L6.2 VT11.1(DRAIN) VT12.3(COLLECTOR)
N$31: C50.1 DA6.3(POSITIVE) R77.1 R81.1
N$32: C60.1 DA7.2(.1:NEGATIVE) R104.2 R105.1
N$33: R91.2 R94.1 VT15.3(GATE)
N$34: C58.2 R91.1
N$35: C52.1 DA6.4(+U) L7.2
N$36: R95.2 VT17.3(COLLECTOR)
N$37: R100.1 VT17.2(EMITTER)
N$38: R101.1 VT18.2(EMITTER)
N$39: R95.1 VT15.2(SOURCE) VT16.1(BASE)
N$40: R98.1 R105.2 VT16.2(EMITTER) VT18.3(COLLECTOR)
N$41: C63.1 L11.2 R100.2 R101.2
N$42: C57.1 L9.2 VT15.1(DRAIN) VT16.3(COLLECTOR)
N$43: C61.1 DA8.4(+U) L10.2
N$44: C59.1 DA8.3(POSITIVE) R92.1 R96.1
N$45: C60.2 R99.1 R102.1
N$46: DA7.1(.1:OUT) R94.2 R99.2
N$47: DA8.1(NEGATIVE) R98.2
N$48: C64.1 DA7.7(.2:OUT) R103.1 R104.1
SUP_+3V3A: L7.1 L10.1 R81.2 R96.2 ; also sheet 1,2,3
SUP_+5V0A: C47.1 C56.1 DA5.8(.1:+U) DA7.8(.1:+U) L6.1 L9.1 ; also sheet 2,3
SUP_-2V5A: C53.1 C62.1 DA5.4(.1:-U) DA7.4(.1:-U) L8.1 L11.1 ; also sheet 2,3

## Library data of the parts
C1-C32 C34 C35 C37-C64 = library:CAPACITOR/GENERIC
C33 C36 = library:CAPACITOR/TRIM
DA1 DA3 DA4 = library:ANALOG/REGULATOR/LDK120: LDK120 low power voltage regulator.
DA2 = library:ANALOG/OPAMP/LMV321: LMV321 operation amp series...
DA5 DA7 = library:ANALOG/OPAMP/LM158: LM158-LM358, LM2902, 4558, TL082, AD8542, AD8056, AD8552, AD822,TLC272,TL0x2... operation amplifier series.
DA6 DA8 = library:ANALOG/COMPARATOR/TLV3501: TLV3501 high-speed comparator series.
DD1 = library:DIGITAL/USBLC6: USBLC6 ESD protection series.
DD2 = library:DIGITAL/STM32F10XCXX: STM32F10xCxx MCU series.
DD3 = library:DIGITAL/ADUM1200: ADUM1200 iCoupler series.
DD4 = library:DIGITAL/ADUM1201: ADUM1201 iCoupler series.
DD5 = library:DIGITAL/74HC2G17: 74ALS, 74HC, 74AC ... series.
DD6 = library:DIGITAL/EPM240: EPM240T100 Altera MAX II CPLD series.
DD7 = library:DIGITAL/74HC1G17: 74ALS, 74HC, 74AC ... series.
FU1 = library:FUSE
K1 K2 = library:RELAY/2NCNO: TRIx-xxx, IMxx relay series.
L1-L11 = library:INDUCTOR/CORE
R1-R105 = library:RESISTOR/0.125
T1 = library:TRANSFORMER/2-2-2-2
U1 = library:TRANSISTOR/OPTRON/TLP521-1: TL521-1, PC357, PC817, ... optocouple.
VD1-VD4 VD6 VD9 = library:DIODE/SCHOTTKY: SR360, 10MQ040, ... schottky diode series.
VD5 = library:DIODE/LED
VD7 VD8 VD10 = library:DIODE/2/AC: BAV99 diodes.
VT1 VT5 VT6 VT8 VT9 = library:TRANSISTOR/PNP: BC856-BC860, BC556-BC560, ...,2T3109, 2SA1244 pnp transistor series.
VT2 = library:TRANSISTOR/MOSFET/2NE: IRF7103, IRF7303, IRF7313 MOSFET series.
VT3 VT4 = library:TRANSISTOR/NPN/SWITCH: DTC144, BCR108 ... transistors.
VT7 VT10 VT12-VT14 VT16-VT18 = library:TRANSISTOR/NPN: BC846-BC850, BC546-BC550, ... 2SD1820, BC635 - BC639, 2N4401 npn transistor series.
VT11 VT15 = library:TRANSISTOR/JFET/N: BF245, MMBFJ310, 2SK212 JFET-N series.
XS1 XS3 = library:CONNECTOR/4
XS2 = library:CONNECTOR:6
XS4 = library:CONNECTOR/6
XS5-XS7 = library:CONNECTOR/2/BNC
ZQ1 = library:QUARTZ/GENERIC
ZQ2 = library:QUARTZ/BLOCK